# EAGLE design Smart_Dashboard (EAGLE 9.5.1)

## Sheet 1 of 3
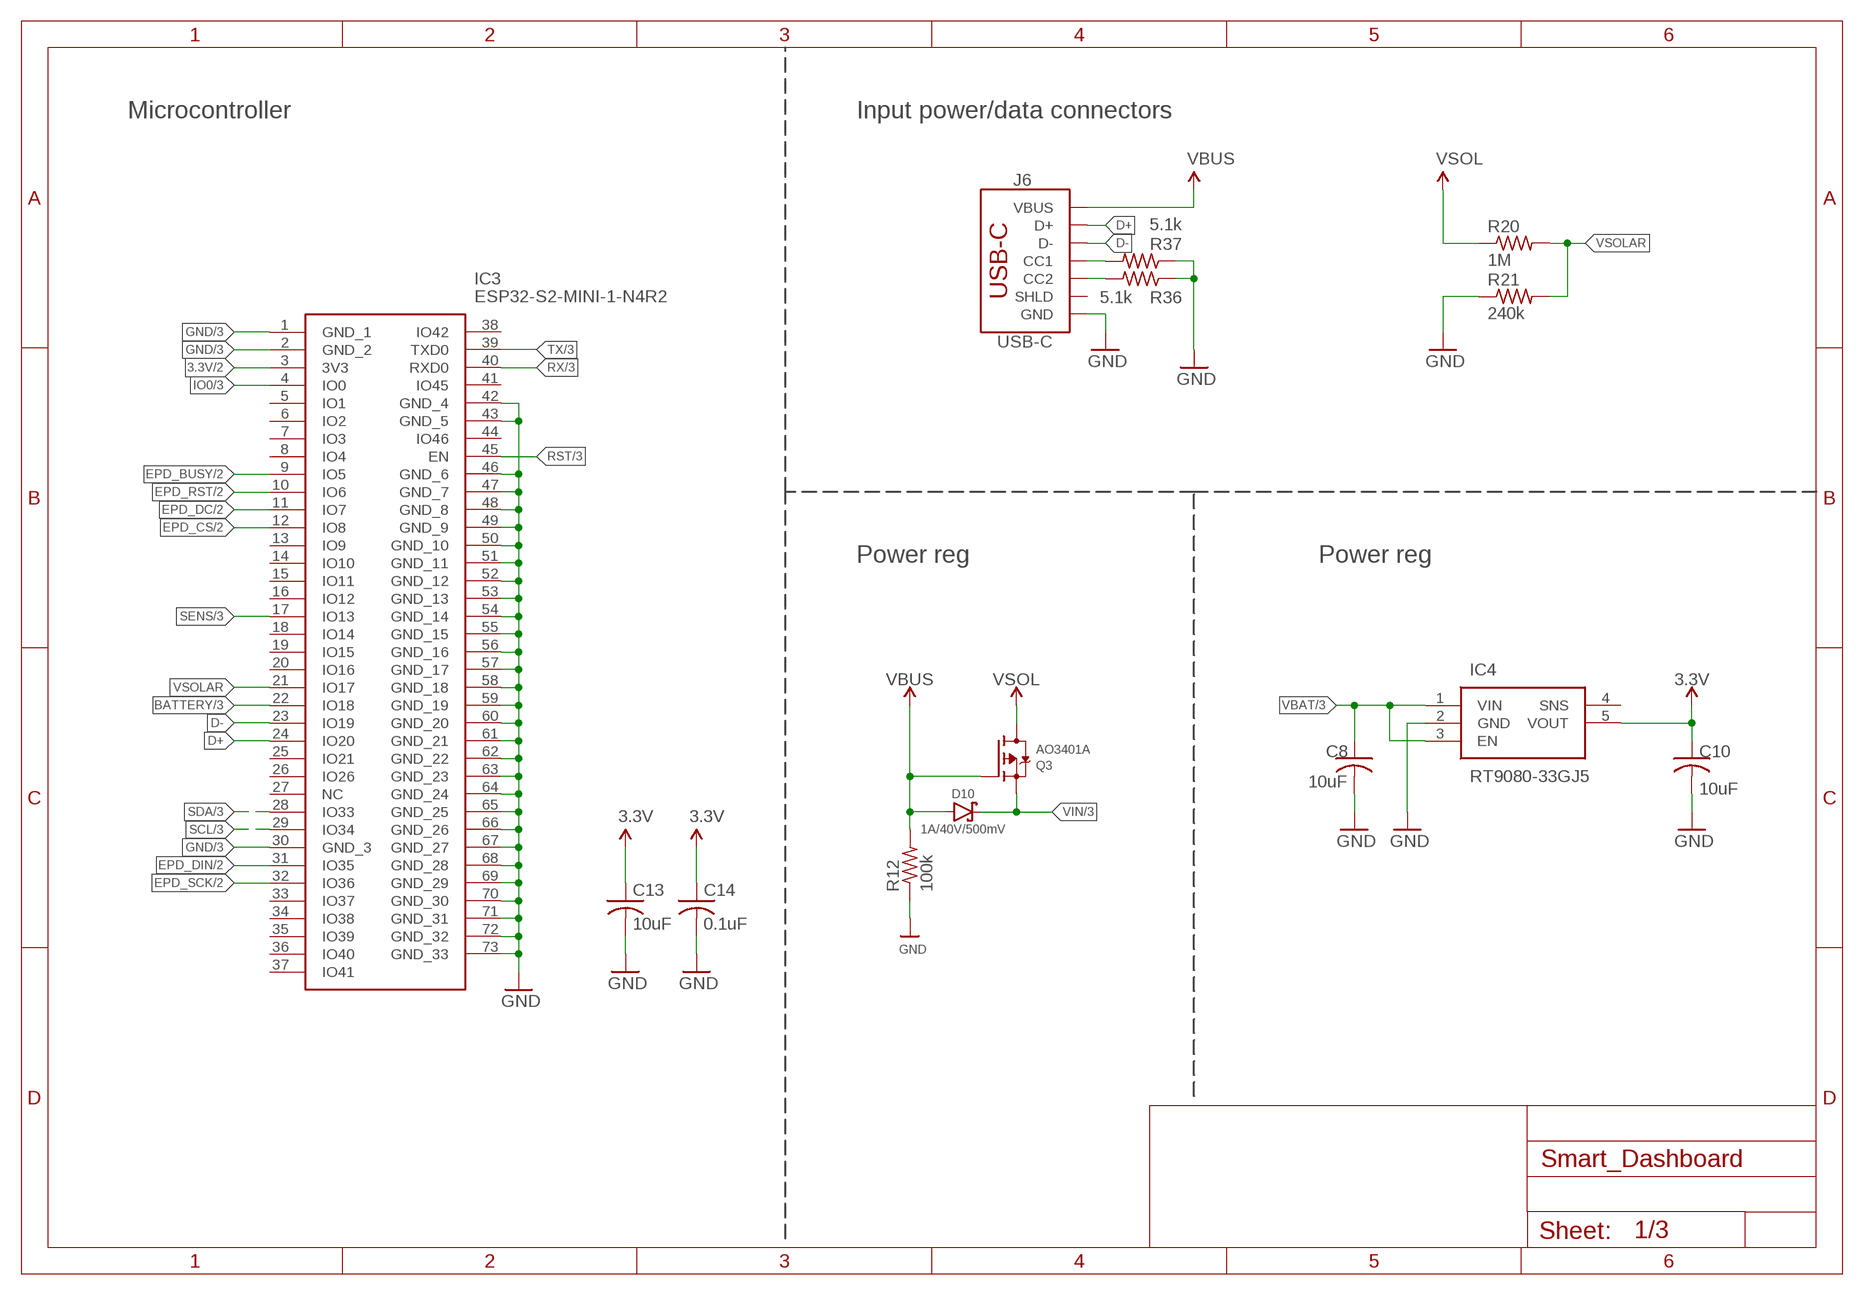
[diagram p0: schematic, sheet 1]

### Parts
C8  10uF  C-USC0603  [C0603]
C10  10uF  C-USC0603  [C0603]
C13  10uF  C-USC0603  [C0603]
C14  0.1uF  C-USC0603  [C0603]
D10  1A/40V/500mV  DIODE-SCHOTTKYSS14  [SMA-DIODE]
IC3  ESP32-S2-MINI-1-N4R2  [ESP32S2MINI1N4R2]
IC4  RT9080-33GJ5  [SOT94P280X100-5N]
J6  USB-C  USB_C_4-LAYER-ISOLATED  [USB-C-16P-4LAYER-ISOLATED]
Q3  AO3401A  MOSFET-P  [SOT23-R]
R12  100k  R-US_R0603  [R0603]
R20  1M  R-US_R0603  [R0603]
R21  240k  R-US_R0603  [R0603]
R36  5.1k  R-US_R0603  [R0603]
R37  5.1k  R-US_R0603  [R0603]

### Nets
3.3V: C10.1 C13.1 C14.1 IC3.3(3V3) IC4.5(VOUT) ; also sheet 2,3
BATTERY: IC3.22(IO18) ; also sheet 3
CC3: J6.B5(CC2) R36.2
CC4: J6.A5(CC1) R37.2
D+: IC3.24(IO20) J6.A6(D+) J6.B6(D+)
D-: IC3.23(IO19) J6.A7(D-) J6.B7(D-)
EPD_BUSY: IC3.9(IO5) ; also sheet 2
EPD_CS: IC3.12(IO8) ; also sheet 2
EPD_DC: IC3.11(IO7) ; also sheet 2
EPD_DIN: IC3.31(IO35) ; also sheet 2
EPD_RST: IC3.10(IO6) ; also sheet 2
EPD_SCK: IC3.32(IO36) ; also sheet 2
GND: C8.2 C10.2 C13.2 C14.2 IC3.1(GND_1) IC3.2(GND_2) IC3.30(GND_3) IC3.42(GND_4) IC3.43(GND_5) IC3.46(GND_6) IC3.47(GND_7) IC3.48(GND_8) IC3.49(GND_9) IC3.50(GND_10) IC3.51(GND_11) IC3.52(GND_12) IC3.53(GND_13) IC3.54(GND_14) IC3.55(GND_15) IC3.56(GND_16) IC3.57(GND_17) IC3.58(GND_18) IC3.59(GND_19) IC3.60(GND_20) IC3.61(GND_21) IC3.62(GND_22) IC3.63(GND_23) IC3.64(GND_24) IC3.65(GND_25) IC3.66(GND_26) IC3.67(GND_27) IC3.68(GND_28) IC3.69(GND_29) IC3.70(GND_30) IC3.71(GND_31) IC3.72(GND_32) IC3.73(GND_33) IC4.2(GND) J6.GND J6.GND2(GND) R12.1 R21.1 R36.1 R37.1 ; also sheet 2,3
IO0: IC3.4(IO0) ; also sheet 3
RST: IC3.45(EN) ; also sheet 3
RX: IC3.40(RXD0) ; also sheet 3
SCL: IC3.29(IO34) ; also sheet 3
SDA: IC3.28(IO33) ; also sheet 3
SENS: IC3.17(IO13) ; also sheet 3
TX: IC3.39(TXD0) ; also sheet 3
VBAT: C8.1 IC4.1(VIN) IC4.3(EN) ; also sheet 3
VBUS: D10.A J6.VBUS1(VBUS) J6.VBUS2(VBUS) Q3.1(G) R12.2
VIN: D10.C Q3.2(S) ; also sheet 3
VSOL: Q3.3(D) R20.1
VSOLAR: IC3.21(IO17) R20.2 R21.2
Unconnected: IC3.5(IO1) IC3.6(IO2) IC3.7(IO3) IC3.8(IO4) IC3.13(IO9) IC3.14(IO10) IC3.15(IO11) IC3.16(IO12) IC3.18(IO14) IC3.19(IO15) IC3.20(IO16) IC3.25(IO21) IC3.26(IO26) IC3.27(NC) IC3.33(IO37) IC3.34(IO38) IC3.35(IO39) IC3.36(IO40) IC3.37(IO41) IC3.38(IO42) IC3.41(IO45) IC3.44(IO46) IC4.4(SNS) J6.SHLD1(SHLD) J6.SHLD2(SHLD) J6.SHLD3(SHLD) J6.SHLD4(SHLD) J6.SHLD5(SHLD) J6.SHLD6(SHLD) J6.SHLD7(SHLD) J6.SHLD8(SHLD)

### Notes on the sheet
- Microcontroller | Input power/data connectors
- Power reg | Power reg

## Sheet 2 of 3
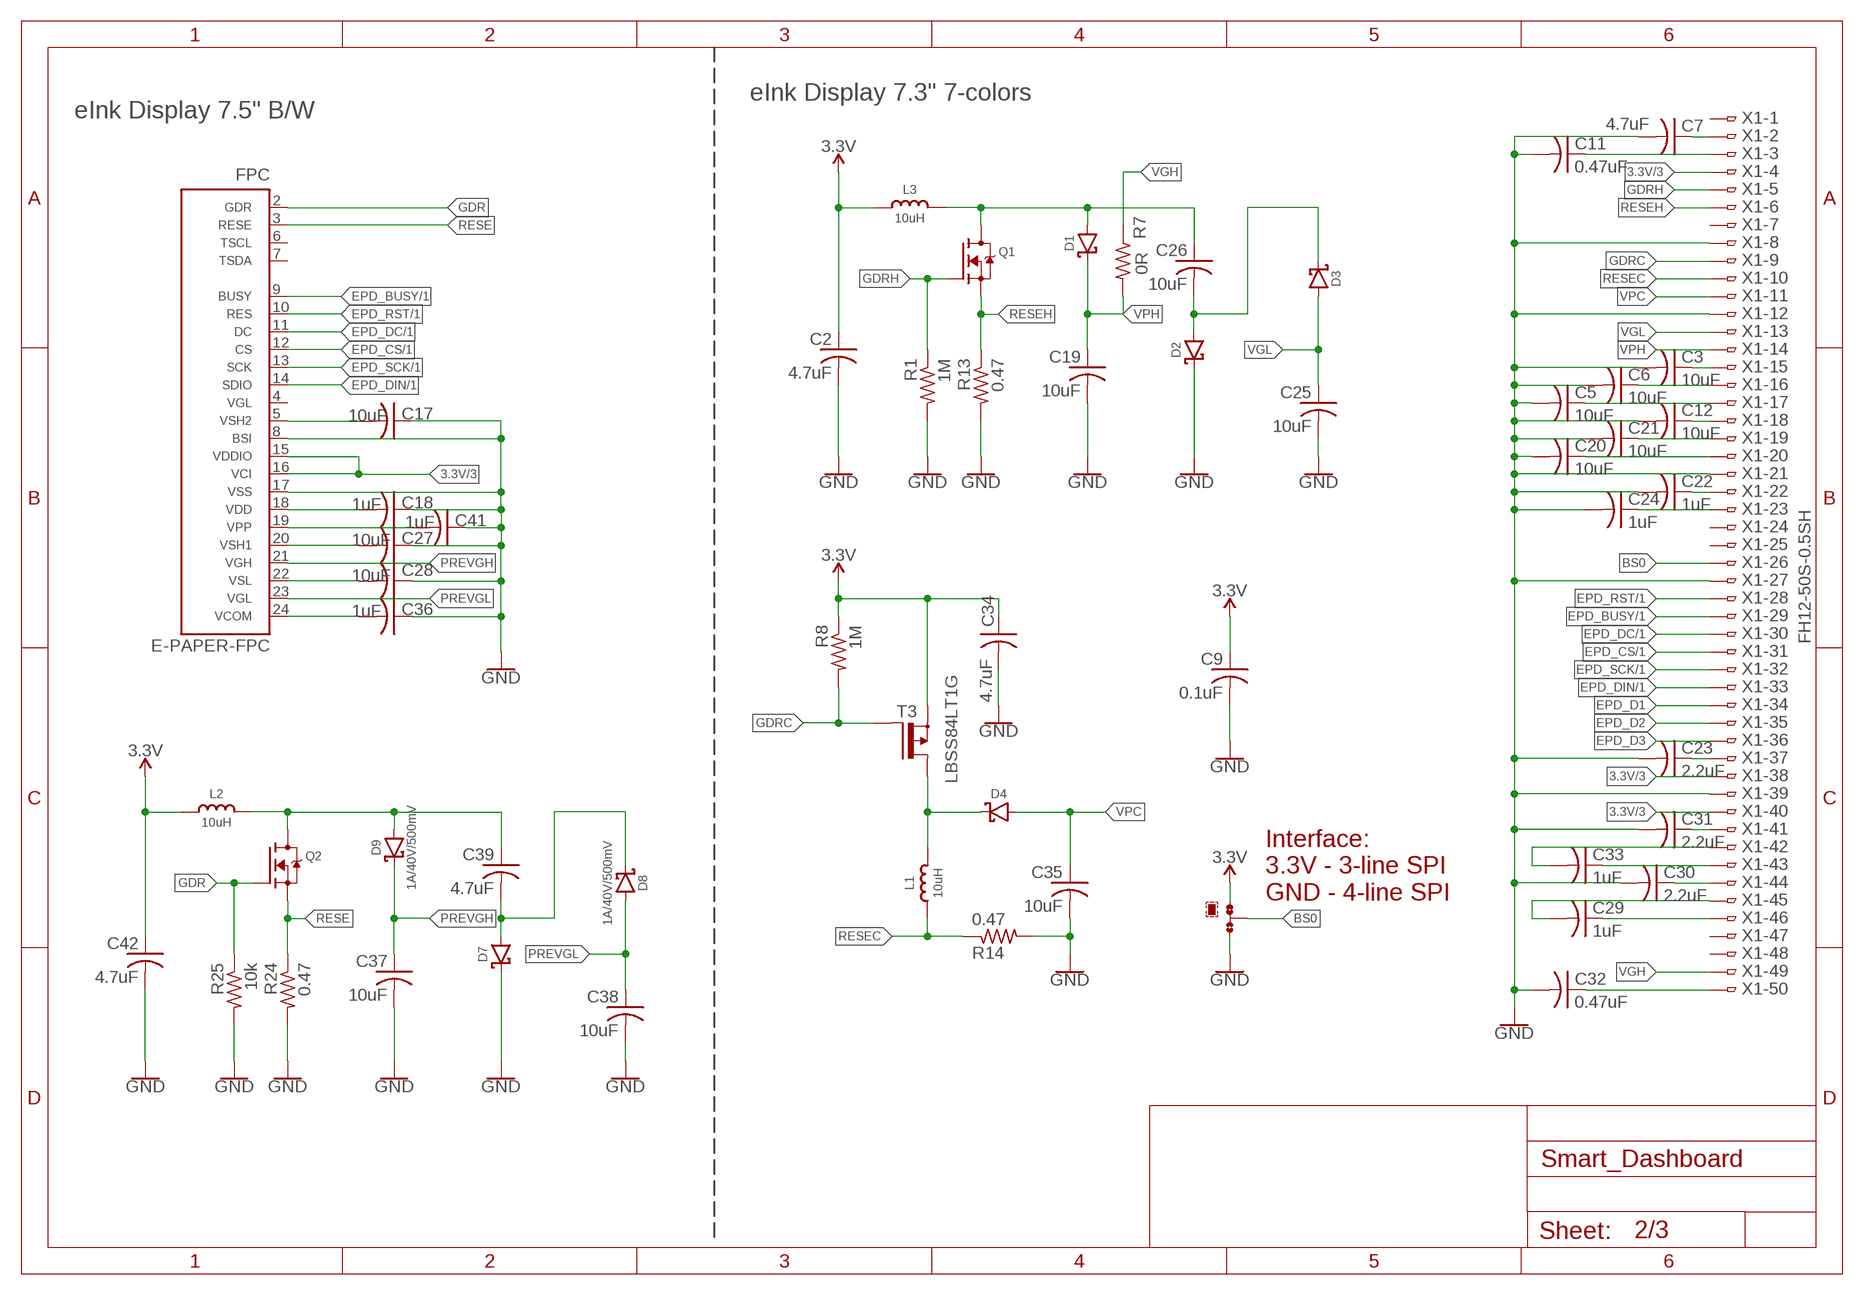
[diagram p1: schematic, sheet 2]

### Parts
C2  4.7uF  C-USC0603  [C0603]
C3  10uF  C-USC0603  [C0603]
C5  10uF  C-USC0603  [C0603]
C6  10uF  C-USC0603  [C0603]
C7  4.7uF  C-USC0603  [C0603]
C9  0.1uF  C-USC0603  [C0603]
C11  0.47uF  C-USC0603  [C0603]
C12  10uF  C-USC0603  [C0603]
C17  10uF  C-USC0603  [C0603]
C18  1uF  C-USC0603  [C0603]
C19  10uF  C-USC0603  [C0603]
C20  10uF  C-USC0603  [C0603]
C21  10uF  C-USC0603  [C0603]
C22  1uF  C-USC0603  [C0603]
C23  2.2uF  C-USC0603  [C0603]
C24  1uF  C-USC0603  [C0603]
C25  10uF  C-USC0603  [C0603]
C26  10uF  C-USC0603  [C0603]
C27  10uF  C-USC0603  [C0603]
C28  10uF  C-USC0603  [C0603]
C29  1uF  C-USC0603  [C0603]
C30  2.2uF  C-USC0603  [C0603]
C31  2.2uF  C-USC0603  [C0603]
C32  0.47uF  C-USC0603  [C0603]
C33  1uF  C-USC0603  [C0603]
C34  4.7uF  C-USC0603  [C0603]
C35  10uF  C-USC0603  [C0603]
C36  1uF  C-USC0603  [C0603]
C37  10uF  C-USC0603  [C0603]
C38  10uF  C-USC0603  [C0603]
C39  4.7uF  C-USC0603  [C0603]
C41  1uF  C-USC0603  [C0603]
C42  4.7uF  C-USC0603  [C0603]
D1  1A/40V/500mV  DIODE-SCHOTTKYSS14  [SMA-DIODE]
D2  1A/40V/500mV  DIODE-SCHOTTKYSS14  [SMA-DIODE]
D3  1A/40V/500mV  DIODE-SCHOTTKYSS14  [SMA-DIODE]
D4  1A/40V/500mV  DIODE-SCHOTTKYSS14  [SMA-DIODE]
D7  1A/40V/500mV  DIODE-SCHOTTKYSS14  [SMA-DIODE]
D8  1A/40V/500mV  DIODE-SCHOTTKYSS14  [SMA-DIODE]
D9  1A/40V/500mV  DIODE-SCHOTTKYSS14  [SMA-DIODE]
FPC  E-PAPER-FPC  [FPC-05FB-24PH20]
JMP1  0R-JUMPA  [A0R-JMP]
L1  10uH  INDUCTORNR401  [INDUCTOR_4X4MM_NR401]
L2  10uH  INDUCTORNR401  [INDUCTOR_4X4MM_NR401]
L3  10uH  INDUCTORNR401  [INDUCTOR_4X4MM_NR401]
Q1  IRLML0100  IRLML2060TRPBF  [SOT23-3]
Q2  IRLML0100  IRLML2060TRPBF  [SOT23-3]
R1  1M  R-US_R0603  [R0603]
R7  0R  R-US_R0603  [R0603]
R8  1M  R-US_R0603  [R0603]
R13  0.47  R-US_R0603  [R0603]
R14  0.47  R-US_R0603  [R0603]
R24  0.47  R-US_R0603  [R0603]
R25  10k  R-US_R0603  [R0603]
T3  LBSS84LT1G  T_P-MOSFET_LBSS84LT1G_LRC_SOT23-GSD  [SOT23]
X1  FH12-50S-0.5SH  [FH12-50S-0.5SH]

### Nets
3.3V: C2.1 C9.1 C34.1 C42.1 FPC.15 FPC.16 JMP1.1 L2.P$2 L3.P$2 R8.1 T3.2(S) X1.4 X1.38 X1.40 ; also sheet 1,3
BS0: JMP1.2 X1.26
EPD_BUSY: FPC.9 X1.29 ; also sheet 1
EPD_CS: FPC.12 X1.31 ; also sheet 1
EPD_D1: X1.34
EPD_D2: X1.35
EPD_D3: X1.36
EPD_DC: FPC.11 X1.30 ; also sheet 1
EPD_DIN: FPC.14 X1.33 ; also sheet 1
EPD_RST: FPC.10 X1.28 ; also sheet 1
EPD_SCK: FPC.13 X1.32 ; also sheet 1
GDR: FPC.2 Q2.1(G) R25.1
GDRC: R8.2 T3.1(G) X1.9
GDRH: Q1.1(G) R1.1 X1.5
GND: C2.2 C3.2 C5.2 C6.2 C7.2 C9.2 C11.2 C12.2 C17.1 C18.1 C19.2 C20.2 C21.2 C22.2 C23.2 C24.2 C25.2 C27.1 C28.1 C30.2 C31.2 C32.2 C34.2 C35.2 C36.1 C37.2 C38.2 C41.1 C42.2 D2.C D7.C FPC.8 FPC.17 JMP1.3 R1.2 R13.2 R14.2 R24.2 R25.2 X1.8 X1.12 X1.21 X1.27 X1.39 ; also sheet 1,3
N$5: C7.1 X1.2
N$7: C3.1 X1.15
N$8: C5.1 X1.17
N$12: C17.2 FPC.5
N$14: C18.2 FPC.18
N$15: C27.2 FPC.20
N$16: C26.2 D2.A D3.C
N$17: C26.1 D1.A L3.P$1 Q1.3(D)
N$31: C28.2 FPC.22
N$32: C36.2 FPC.24
N$35: C6.1 X1.16
N$47: C11.1 X1.3
N$49: C12.1 X1.18
N$50: C20.1 X1.20
N$51: C21.1 X1.19
N$52: C22.1 X1.22
N$53: C23.1 X1.37
N$54: C24.1 X1.23
N$55: C29.1 X1.46
N$56: C29.2 X1.45
N$57: C30.1 X1.44
N$58: C31.1 X1.41
N$59: C32.1 X1.50
N$61: C33.1 X1.43
N$62: C33.2 X1.42
N$63: C39.2 D7.A D8.C
N$64: D4.C L1.P$1 T3.3(D)
N$65: C39.1 D9.A L2.P$1 Q2.3(D)
N$67: C41.2 FPC.19
PREVGH: C37.1 D9.C FPC.21
PREVGL: C38.1 D8.A FPC.23
RESE: FPC.3 Q2.2(S) R24.1
RESEC: L1.P$2 R14.1 X1.10
RESEH: Q1.2(S) R13.1 X1.6
VGH: R7.1 X1.49
VGL: C25.1 D3.A X1.13
VPC: C35.1 D4.A X1.11
VPH: C19.1 D1.C R7.2 X1.14
Unconnected: FPC.4 FPC.6 FPC.7 X1.1 X1.7 X1.24 X1.25 X1.47 X1.48

### Notes on the sheet
- eInk Display 7.3" 7-colors
- eInk Display 7.5" B/W
- Interface:
  3.3V - 3-line SPI
  GND - 4-line SPI

## Sheet 3 of 3
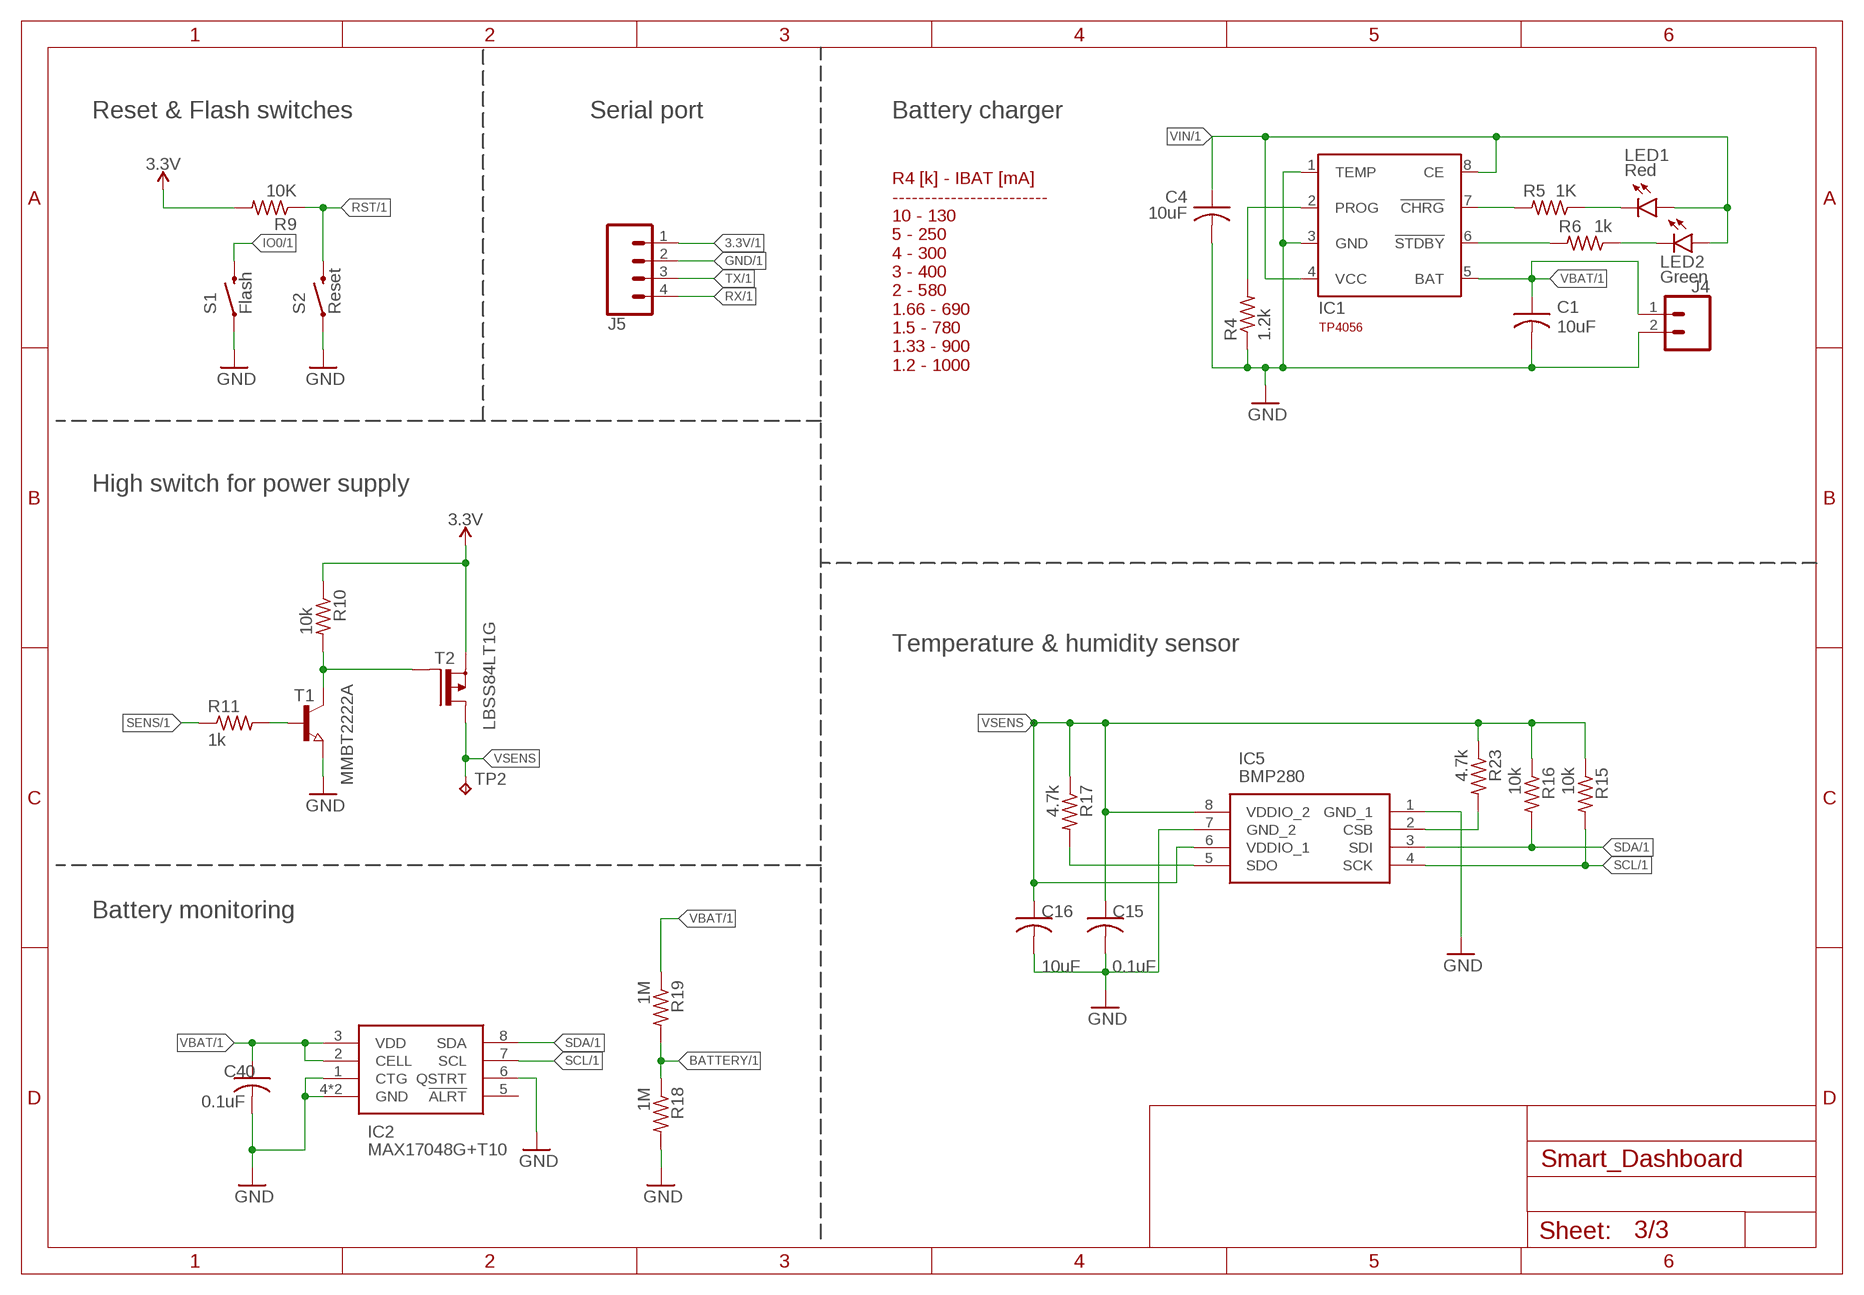
[diagram p2: schematic, sheet 3]

### Parts
C1  10uF  C-USC0603  [C0603]
C4  10uF  C-USC0603  [C0603]
C15  0.1uF  C-USC0603  [C0603]
C16  10uF  C-USC0603  [C0603]
C40  0.1uF  C-USC0603  [C0603]
IC1  TP4056  [SOT23-8]
IC2  MAX17048G+T10  [SON50P200X200X80-9N]
IC5  BMP280  [8-PIN-METAL-LID-LGA]
J4  CONN_02-JST-2MM-SMT  [JST-2-SMD]
J5  CONN_04PTH  [1X04]
LED1  Red  LED0603  [LED_0603]
LED2  Green  LED0603  [LED_0603]
R4  1.2k  R-US_R0603  [R0603]
R5  1K  R-US_R0603  [R0603]
R6  1k  R-US_R0603  [R0603]
R9  10K  R-US_R0603  [R0603]
R10  10k  R-US_R0603  [R0603]
R11  1k  R-US_R0603  [R0603]
R15  10k  R-US_R0603  [R0603]
R16  10k  R-US_R0603  [R0603]
R17  4.7k  R-US_R0603  [R0603]
R18  1M  R-US_R0603  [R0603]
R19  1M  R-US_R0603  [R0603]
R23  4.7k  R-US_R0603  [R0603]
S1  Flash  MOMENTARY-SWITCH-SPST-SMD-5.2MM-TALL  [TACTILE_SWITCH_SMD_5.2MM]
S2  Reset  MOMENTARY-SWITCH-SPST-SMD-5.2MM-TALL  [TACTILE_SWITCH_SMD_5.2MM]
T1  MMBT2222A  T_NPN_MMBT2222A-1P_CHANGJ_SOT23-BEC  [SOT23]
T2  LBSS84LT1G  T_P-MOSFET_LBSS84LT1G_LRC_SOT23-GSD  [SOT23]
TP2  TPB1,27  [B1,27]

### Nets
3.3V: J5.1 R9.2 R10.1 T2.2(S) ; also sheet 1,2
BATTERY: R18.1 R19.2 ; also sheet 1
GND: C1.2 C4.2 C15.2 C16.2 C40.2 IC1.1(TEMP) IC1.3(GND) IC2.1(CTG) IC2.4(GND) IC2.6(QSTRT) IC2.9(GND) IC5.1(GND_1) IC5.7(GND_2) J4.2 J5.2 R4.1 R18.2 S1.1 S2.1 T1.2(E) ; also sheet 1,2
IO0: S1.3 ; also sheet 1
N$1: IC1.6(!STDBY) R6.2
N$2: LED1.C R5.1
N$3: LED2.C R6.1
N$4: IC1.2(PROG) R4.2
N$6: IC1.7(!CHRG) R5.2
N$9: R10.2 T1.3(C) T2.1(G)
N$10: IC5.5(SDO) R17.2
N$13: IC5.2(CSB) R23.2
N$18: R11.2 T1.1(B)
RST: R9.1 S2.3 ; also sheet 1
RX: J5.4 ; also sheet 1
SCL: IC2.7(SCL) IC5.4(SCK) R15.2 ; also sheet 1
SDA: IC2.8(SDA) IC5.3(SDI) R16.2 ; also sheet 1
SENS: R11.1 ; also sheet 1
TX: J5.3 ; also sheet 1
VBAT: C1.1 C40.1 IC1.5(BAT) IC2.2(CELL) IC2.3(VDD) J4.1 R19.1 ; also sheet 1
VIN: C4.1 IC1.4(VCC) IC1.8(CE) LED1.A LED2.A ; also sheet 1
VSENS: C15.1 C16.1 IC5.6(VDDIO_1) IC5.8(VDDIO_2) R15.1 R16.1 R17.1 R23.1 T2.3(D) TP2.TP
Unconnected: IC2.5(!ALRT)

### Notes on the sheet
- Reset & Flash switches | Serial port | Battery charger
- R4 [k] - IBAT [mA]
  ------------------------
  10 - 130
  5 - 250
  4 - 300
  3 - 400
  2 - 580
  1.66 - 690
  1.5 - 780
  1.33 - 900
  1.2 - 1000
- High switch for power supply
- Temperature & humidity sensor
- Battery monitoring

## Library data of the parts
C1-C42 = rcl:C-US: CAPACITOR, American symbol; SPICEPREFIX: C
D1-D4 D7-D10 = SpaceDIY_semiconductors:DIODE-SCHOTTKY: Schottky diode A Schottky diode is a semiconductor diode which has a low forward voltage drop and a very fast switching action.; PROD_ID: DIO-08053
FPC = SpaceDIY_connectors:E-PAPER-FPC; LCSC: C2856831
IC1 = TP4056:TP4056: TP4056 Data sheet <http://goo.gl/J7k8TF> Dave.Calaway Eagle Library <https://goo.gl/Muy1Tr>; LCSC: C16581
IC2 = SpaceDIY_IC:MAX17048G+T10: Battery Management Host-Side Modelgauge (1-Cell) Source: Datasheet <https://datasheets.maximintegrated.com/en/ds/MAX17048-MAX17049.pdf>; LCSC: C2682616
IC3 = SpaceDIY_modules:ESP32-S2-MINI-1-N4R2: WiFi Modules - 802.11 SMD module, ESP32-S2FN4R2 with 4 MB flash die and 2 MB PSRAM die inside, PCB antenna Source: Datasheet <https://cz.mouser.com/datasheet/2/891/esp32_s2_mini_1_esp32_s2_mini_1u_datasheet_en-1928084.pdf>; DESCRIPTION: WiFi Modules - 802.11 SMD module, ESP32-S2FN4R2 with 4 MB flash die and 2 MB PSRAM die inside, PCB antenna; HEIGHT: 2.55mm; MANUFACTURER_NAME: Espressif Systems; MANUFACTURER_PART_NUMBER: ESP32-S2-MINI-1-N4R2; MOUSER_PART_NUMBER: 356-ESP32S2MINI1N4R2; MOUSER_PRICE-STOCK: https://www.mouser.co.uk/ProductDetail/Espressif-Systems/ESP32-S2-MINI-1-N4R2?qs=iLbezkQI%252Bsgb61FCBnw%252B9A%3D%3D
IC4 = SamacSys_Parts:RT9080-33GJ5: IC REG LIN 3.3V 600MA TSOT23-5 Source: Datasheet <https://www.richtek.com/assets/product_file/RT9080/DS9080-05.pdf>; DESCRIPTION: IC REG LIN 3.3V 600MA TSOT23-5; HEIGHT: 1mm; LCSC: C841192; MANUFACTURER_NAME: RICHTEK; MANUFACTURER_PART_NUMBER: RT9080-33GJ5
IC5 = SamacSys_Parts:BMP280: Digital Pressure Sensor Source: Datasheet <https://datasheet.datasheetarchive.com/originals/distributors/DKDS-24/462913.pdf>; ARROW_PART_NUMBER: BMP280; ARROW_PRICE-STOCK: https://www.arrow.com/en/products/bmp280/bosch?region=nac; DESCRIPTION: Digital Pressure Sensor; HEIGHT: mm; MANUFACTURER_NAME: BOSCH; MANUFACTURER_PART_NUMBER: bmp280; MOUSER_PART_NUMBER: 262-BMP280; MOUSER_PRICE-STOCK: https://www.mouser.co.uk/ProductDetail/Bosch-Sensortec/BMP280?qs=QhAb4EtQfbUP9Z%252BCHM3Wyg%3D%3D
J4 = SpaceDIY_connectors:CONN_02: Multi connection point. Often used as Generic Header-pin footprint for 0.1 inch spaced/style header connections On any of the 0.1 inch spaced packages, you can populate with these: Break Away Headers - Straight <https://www.sparkfun.com/products/116> (PRT-00116) Break Away Male Headers - Right Angle <https://www.sparkfun.com/products/553> (PRT-00553) Female Headers <https://www.sparkfun.com/products/115> (PRT-00115) Break Away Headers - Machine Pin <https://www.sparkfun.com/products/117> (PRT-00117) Break Away Female Headers - Swiss Machine Pin <https://www.sparkfun.com/products/743> (PRT-00743) For SCREWTERMINALS and SPRING TERMINALS visit here: Screw Terimnals on SparkFun.com <https://www.sparkfun.com/search/results?term=Screw+Terminals> (5mm/3.5mm/2.54mm spacing) This device is also useful as a general connection point to wire up your design to another part of your project. Our various solder wires solder well into these plated through hole pads. Hook-Up Wire - Assortment (Stranded, 22 AWG) <https://www.sparkfun.com/products/11375> (PRT-11375) Hook-Up Wire - Assortment (Solid Core, 22 AWG) <https://www.sparkfun.com/products/11367> (PRT-11367) View the entire wire category on our website here <https://www.sparkfun.com/categories/141> Special notes: Molex polarized connector foot print use with: PRT-08233 with associated crimp pins and housings. 2.54_SCREWTERM for use with PRT-10571. 3.5mm Screw Terminal footprints for PRT-08084 5mm Screw Terminal footprints for use with PRT-08432; LCSC: C3029440; PROD_ID: CONN-11443
J5 = SparkFun-Connectors:CONN_04: Multi connection point. Often used as Generic Header-pin footprint for 0.1 inch spaced/style header connections On any of the 0.1 inch spaced packages, you can populate with these: Break Away Headers - Straight <https://www.sparkfun.com/products/116> (PRT-00116) Break Away Male Headers - Right Angle <https://www.sparkfun.com/products/553> (PRT-00553) Female Headers <https://www.sparkfun.com/products/115> (PRT-00115) Break Away Headers - Machine Pin <https://www.sparkfun.com/products/117> (PRT-00117) Break Away Female Headers - Swiss Machine Pin <https://www.sparkfun.com/products/743> (PRT-00743) For SCREWTERMINALS and SPRING TERMINALS visit here: Screw Terimnals on SparkFun.com <https://www.sparkfun.com/search/results?term=Screw+Terminals> (5mm/3.5mm/2.54mm spacing) This device is also useful as a general connection point to wire up your design to another part of your project. Our various solder wires solder well into these plated through hole pads. Hook-Up Wire - Assortment (Stranded, 22 AWG) <https://www.sparkfun.com/products/11375> (PRT-11375) Hook-Up Wire - Assortment (Solid Core, 22 AWG) <https://www.sparkfun.com/products/11367> (PRT-11367) View the entire wire category on our website here <https://www.sparkfun.com/categories/141> Special notes: Molex polarized connector foot print use with SKU : PRT-08231 with associated crimp pins and housings. 1MM SMD Version SKU: PRT-10208; PROD_ID: CONN-09696
J6 = SparkFun-Connectors:USB_C: USB Type C 16Pin Connector Super Speed pins not available on the 16-pin purely SMD connector so this part is best for USB 2.0 implementations. D1 and D2 are tied together enabling D+/- no matter which way the cable is plugged into the connector. The two channel configuration pins (CC1/2) are exposed. These are normally connected to ground via 5.1k resistors but can be reconfigured for high current/high power applications. **4-LAYER BOARD WARNING!!** If designing 4-layer board, make sure to select the variant _4-LAYER-ISOLATED. The linked footprint (USB-C-16-4LAYER-ISOLATED) includes some very necessary cutout polygons in the inner layers (2 and 15). This prevents the PTH mounting shield legs on the USB connector from electrically connecting any other polygons on the inner layers (usually VCC and GND).; LCSC: C2765186; PROD_ID: CONN-14122; VALUE: USB Female Type C Connector
JMP1 = jump-0r-smd:0R-JUMP: SMD 0R 0805 Jumper
L1-L3 = microbuilder:INDUCTOR: Inductors 0603: 10nH Ceramic Inductor - microwire antenna/RF (Digikey: 712-1434-2-ND) 0805: 560nH Ceramic Inductor - RF (Digikey: 553-1047-1-ND) 270nH Ceramic Inductor - Q = 40@250MHz, +-5%, 1 Ohm DC Resistance (Digikey: 535-10506-2-ND) 1007 (2518 Metric) SMT: 10µH 10% 250mOhm 820mA 1007 Inductor (Digikey: 587-2189-1-ND) 22µH 10% 500mOhm 580mA 1007 Inductor (Digikey: 587-2190-1-ND) 47µH 10% 950mOhm 420mA 1007 Inductor (Digikey: 587-2191-1-ND) 47µH 5% 100mOhm 1A 1008 Inductor (Digikey: 732-1816-1-ND) 5.0x5.0mm (Taiyo Yuden NR5040 Series) 6.8µH 20% 2.3A 64mOhm Inductor (Digikey: 587-2374-2-ND) 5.0x5.0mm (TDK VLC5045 Series) 4.7µH 20% 3.3A 34mOhm Inductor (Digikey: 445-6526-1-ND) 6.8µH 20% 2.7A 46mOhm Inductor (Digikey: 445-6527-1-ND) 6.0x6.0mm (TDK VLC6045 Series) 4.7µH 20% 3.8A 27mOhm Inductor (Digikey: 445-6538-2-ND) 6.8µH 20% 3A 41mOhm Inductor (Digikey: 445-6540-1-ND) 6.2µH 30% 2.2A 45mOhm Inductor (Digikey: SRR5028-6R2YCT-ND) - Not TDK VLC6045 but footprint should match 6.0x6.0mm (TDK SLF6045 Series) 6.8uH 30% 2A 33mOhm Inductor (Digikey: 445-4572-1-ND, Mouser: 810-SLF645T6R8N2R0PF) 6.0x6.0mm (Sumida CDRH5D28 Series) 6.2uH 30% 1.8A 45mOhm Inductor (Digikey: 308-1542-1-ND) Taiyo Yuden NR3015T2R2M - 2.2uH 20% 1.5A (Digikey: 587-1648-2-ND, Mouser: 963-NR3015T2R2M) - Used with TI TPS62172 CoilCraft RFID Transponder Coil - MA5532-AE (For use with AS3935 Lightning Sensor) Taiyo Yuden NRH2412T2R2MNGH - 2.2uH 20% 1AA (Digikey: 587-3443-1-ND) - Used with TI LM3671 Vishay IHLP 1.0uH Molded Inductor - 24mOhm DCR, 5A, +/-20%, -55°C-125°C (Digikey: 541-1319-1-ND)
LED1 LED2 = SpaceDIY_semiconductors:LED: LED (Generic) Standard schematic elements and footprints for 5mm, 3mm, 0402, 0603 , 0805 and 1206 sized LEDs. Generic LEDs with no color specified.
Q1 Q2 = Parts:IRLML2060TRPBF
Q3 = microbuilder:MOSFET-P: P-Channel Mosfet LEGEND VDS: Voltage Drain-Source ID: Drain Current RDS(ON): Drain-Source On-State Resistance VGS(TH): Gate-Source Threshold Voltage CISS: Drain-Source Input Capacitance SOT-23 Name VDS ID RDS(ON) VGS(TH) CISS Order Number IRLML5103 30V 760mA 600 mOhm -- 75pF @ 25V Digikey: IRLML5103PBFCT-ND IRLML6401 12V 4.3A 50 mOhm 950mV @ 250µA 830pF @ 10V Digikey: IRLML6401PBFTR-ND NTR0202PL 20V 400mA 800 mOhm 2.3V @ 250uA 70pF @ 5V Digikey: NTR0202PLT1GOSTR-ND NTR4101PT1G 20V 1.8A 85 mOhm 1.2V @ 250uA 675pF @ 10V Digikey: NTR4101PT1GOSCT-ND DMP2004K 20V 600mA 900 mOhm 1V @ 250uA 175pF @ 16V Digikey: DMP2004KDICT-ND PMV65XP 20V 3.9A 76 mOhm 950mV @ 1mA 725pF @ 20V Digikey: 568-2358-2-ND TO-252 Name VDS ID RDS(ON) VGS(TH) CISS Order Number AOD417 30V 25A 34 mOhm 3V @ 250µA 920pF @ 15V Digikey: 785-1106-2-ND PowerPak Name VDS ID RDS(ON) VGS(TH) CISS Order Number AON7401 30V 12A 14 mOhm 3V @ 250µA 2600pF @ 15V Digikey: 785-1302-1-ND; LCSC: C15127
R1 R4-R21 R23-R25 R36 R37 = rcl:R-US_: RESISTOR, American symbol; SPICEPREFIX: R
S1 S2 = SpaceDIY_electromechanical:MOMENTARY-SWITCH-SPST: Momentary Switch (Pushbutton) - SPST Normally-open (NO) SPST momentary switches (buttons, pushbuttons). Variants PTH-12MM - 12mm square, through-hole Momentary Pushbutton Switch - 12mm Square <https://www.sparkfun.com/products/9190> (COM-09190) PTH-6.0MM, PTH-6.0MM-KIT - 6.0mm square, through-hole Mini Pushbutton Switch <https://www.sparkfun.com/products/97> (COM-00097) KIT package intended for soldering kit's - only one side of pads' copper is exposed. PTH-RIGHT-ANGLE-KIT - Right-angle, through-hole Right Angle Tactile Button <https://www.sparkfun.com/products/10791> - Used on SparkFun BigTime Watch Kit <https://www.sparkfun.com/products/11734> SMD-12MM - 12mm square, surface-mount Tactile Button - SMD (12mm) <https://www.sparkfun.com/products/12993> (COM-12993) Used on SparkFun PicoBoard <https://www.sparkfun.com/products/11888> SMD-4.5MM - 4.5mm Square Trackball Switch Used on SparkFun Blackberry Trackballer Breakout <https://www.sparkfun.com/products/13169> SMD-4.6MMX2.8MM - 4.60mm x 2.80mm, surface mount Used on SparkFun Pro Micro - RP2040 <https://www.sparkfun.com/products/17717> SMD-5.2MM, SMD-5.2-REDUNDANT - 5.2mm square, surface-mount Mini Pushbutton Switch - SMD <https://www.sparkfun.com/products/8720> (COM-08720) Used on Arduino Pro Mini <https://www.sparkfun.com/products/11114> REDUNDANT package connects both switch circuits together SMD-6.0X3.5MM - 6.0 x 3.5mm, surface mount Momentary Reset Switch SMD <https://www.sparkfun.com/products/8229> (COM-08229) SMD-6.2MM-TALL - 6.2mm square, surface mount Tactile Button - SMD (6mm) <https://www.sparkfun.com/products/12992> Used on SparkFun Digital Sandbox <https://www.sparkfun.com/products/12651> SMD-RIGHT-ANGLE - Right-angle, surface mount Used on SparkFun Block for Intel® Edison - Arduino <https://www.sparkfun.com/products/13036>; LCSC: C318884; PROD_ID: SWCH-14139
T1 = JLC PCB Basic Parts_loc:T_NPN_: Transistor NPN; LCSC_DATASHEET: https://datasheet.lcsc.com/lcsc/1811081957_Changjiang-Electronics-Tech--CJ-MMBT2222A-1P_C8512.pdf; LCSC_PART: C8512; LCSC_PRICE1_EUR: 0.023149606; LCSC_ROTATION_CCW: 180; PROPERTIES: 0.3W NPN 0.6A 40V SOT-23(SOT-23-3) Bipolar Transistors - BJT ROHS
T2 T3 = JLC PCB Basic Parts_loc:T_P-MOSFET_: Transistor P-MOSFET; LCSC_DATASHEET: https://datasheet.lcsc.com/lcsc/1811031711_LRC-LBSS84LT1G_C8492.pdf; LCSC_PART: C8492; LCSC_PRICE1_EUR: 0.031496063; LCSC_ROTATION_CCW: 180; PROPERTIES: 2V 250uA 10Ohm 100mA,5V 0.13A 0.225W P Channel 50V SOT-23(SOT-23-3) MOSFETs ROHS
TP2 = testpad:TP: Test pad
X1 = con-hirose:FH12-50S-0.5S: 0.5mm Pitch Connectors For FPC/FFC Source: Data sheet <http://www.hirose.co.jp/cataloge_hp/e58605370.pdf>; MPN: FH12-50S-0.5SH(55); OC_FARNELL: 1324557; OC_NEWARK: 34M6181

## Net classes
3 Power: width 0.305 mm, drill 0.483 mm

## Board
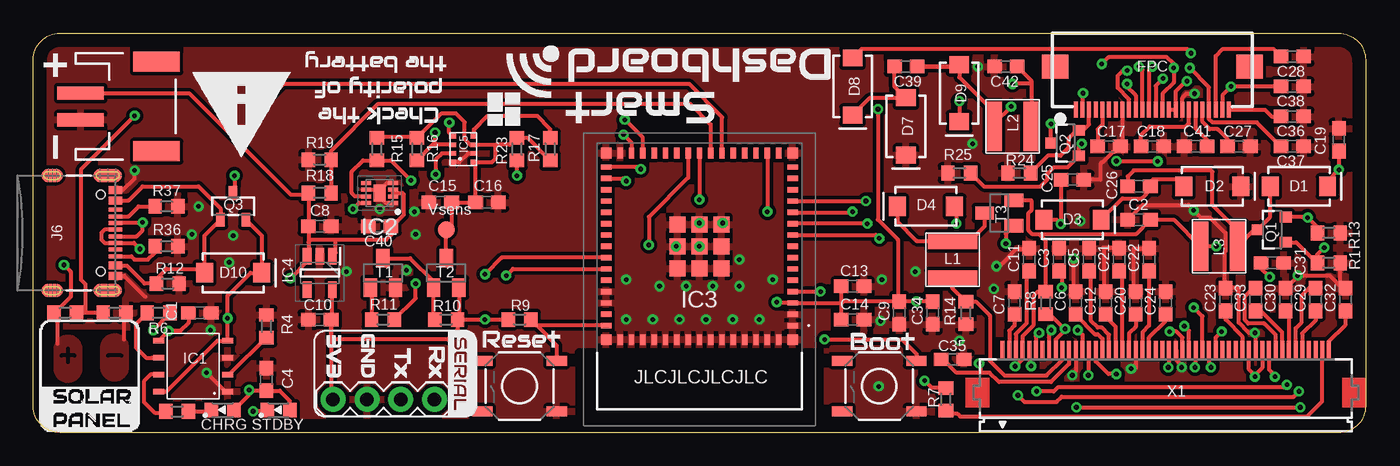
[diagram p3: board, top side]
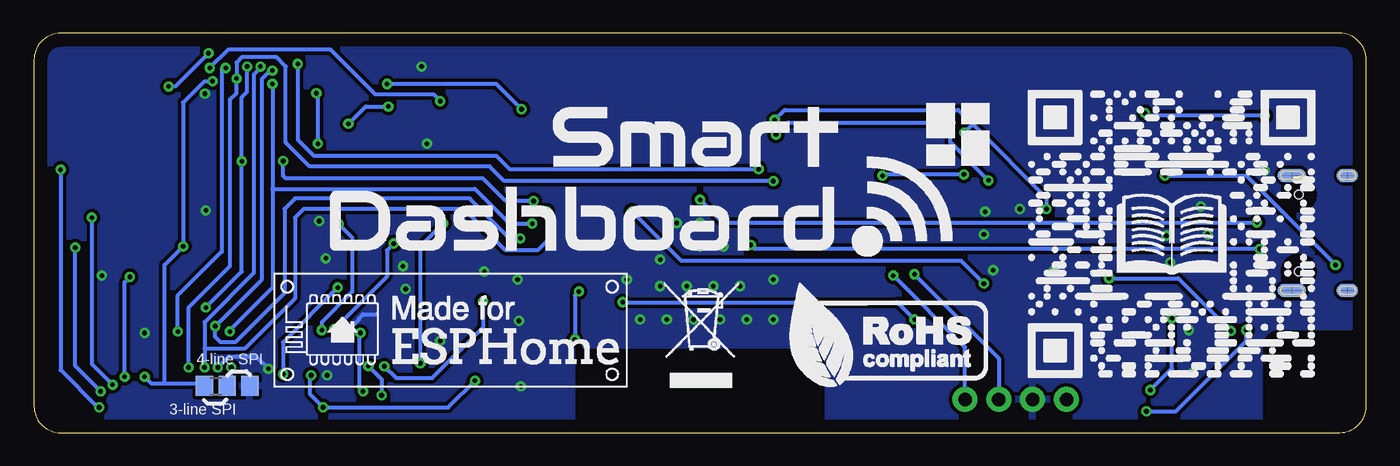
[diagram p4: board, bottom side, seen from below]

Size 100 x 30 mm. Coordinates in mm from the lower left corner, seen from the top.
Outline: 98,30 arc-90 100,28 100,2 arc-90 98,0 2,0 arc-90 0,2 0,28 arc-90 2,30 98,30
Copper layers (1*16): Top 0.035mm / dielectric 1.5mm / Bottom 0.035mm
Design rules "default": minimum track width 6mil, minimum drill 0.35mm, track to track 6mil, track to pad 6mil, pad to pad 6mil, via to via 6mil, smd to smd 6mil, copper to edge 40mil, drill to drill 6mil, minimum pad ring 10mil, minimum via ring 8mil, stop-mask expansion 4mil, vias tented up to drill 0mil, thermal gap 10mil
tRestrict: 3 lines

### Footprints (pad centres in the part's own frame; a part is rotated, then mirrored left to right if it is on the bottom)
C0603 = smd 1.1 x 1: 1 -0.85,0; 2 0.85,0
SMA-DIODE = smd 1.27 x 1.47: A -2.15,0; C 2.15,0
FPC-05FB-24PH20 = smd 0.3 x 1.2: 1 5.75,3.25; 2 5.25,3.25; 3 4.75,3.25; 4 4.25,3.25; 5 3.75,3.25; 6 3.25,3.25; 7 2.75,3.25; 8 2.25,3.25; 9 1.75,3.25; 10 1.25,3.25; 11 0.75,3.25; 12 0.25,3.25; 13 -0.25,3.25; 14 -0.75,3.25; 15 -1.25,3.25; 16 -1.75,3.25; 17 -2.25,3.25; 18 -2.75,3.25; 19 -3.25,3.25; 20 -3.75,3.25; 21 -4.25,3.25; 22 -4.75,3.25; 23 -5.25,3.25; 24 -5.75,3.25 | smd 2 x 1.8: P$25 -7.3,0; P$26 7.3,0
SOT23-8 = smd 0.42 x 0.835: 1 -1.905,-2.58; 2 -0.635,-2.58; 3 0.635,-2.58; 4 1.905,-2.58; 5 1.905,2.58; 6 0.635,2.58; 7 -0.635,2.58; 8 -1.905,2.58
SON50P200X200X80-9N = smd 0.75 x 0.3: 1 -1,0.75; 2 -1,0.25; 3 -1,-0.25; 4 -1,-0.75; 5 1,-0.75; 6 1,-0.25; 7 1,0.25; 8 1,0.75 | smd 0.9 x 1.3: 9 0,0
ESP32S2MINI1N4R2 = smd 0.8 x 0.4: 1 -7,5.95; 2 -7,5.1; 3 -7,4.25; 4 -7,3.4; 5 -7,2.55; 6 -7,1.7; 7 -7,0.85; 8 -7,0; 9 -7,-0.85; 10 -7,-1.7; 11 -7,-2.55; 12 -7,-3.4; 13 -7,-4.25; 14 -7,-5.1; 15 -7,-5.95; 31 7,-5.95; 32 7,-5.1; 33 7,-4.25; 34 7,-3.4; 35 7,-2.55; 36 7,-1.7; 37 7,-0.85; 38 7,0; 39 7,0.85; 40 7,1.7; 41 7,2.55; 42 7,3.4; 43 7,4.25; 44 7,5.1; 45 7,5.95 | smd 0.4 x 0.8: 16 -5.95,-7; 17 -5.1,-7; 18 -4.25,-7; 19 -3.4,-7; 20 -2.55,-7; 21 -1.7,-7; 22 -0.85,-7; 23 0,-7; 24 0.85,-7; 25 1.7,-7; 26 2.55,-7; 27 3.4,-7; 28 4.25,-7; 29 5.1,-7; 30 5.95,-7; 46 5.95,7; 47 5.1,7; 48 4.25,7; 49 3.4,7; 50 2.55,7; 51 1.7,7; 52 0.85,7; 53 0,7; 54 -0.85,7; 55 -1.7,7; 56 -2.55,7; 57 -3.4,7; 58 -4.25,7; 59 -5.1,7; 60 -5.95,7 | smd 1.2 x 1.2: 61 0,0; 66 -1.65,1.65; 67 -1.65,0; 68 -1.65,-1.65; 69 0,-1.65; 70 1.65,-1.65; 71 1.65,0; 72 1.65,1.65; 73 0,1.65 | smd 0.8 x 0.8: 62 -7,7; 63 -7,-7; 64 7,-7; 65 7,7
SOT94P280X100-5N = smd 1.25 x 0.65: 1 -1.25,0.94; 2 -1.25,0; 3 -1.25,-0.94; 4 1.25,-0.94; 5 1.25,0.94
8-PIN-METAL-LID-LGA = smd 0.5 x 0.35: 1 0.8,0.975; 2 0.8,0.325; 3 0.8,-0.325; 4 0.8,-0.975; 5 -0.8,-0.975; 6 -0.8,-0.325; 7 -0.8,0.325; 8 -0.8,0.975
JST-2-SMD = smd 1 x 3.5: 1 1,3.95; 2 -1,3.95 | smd 1.5 x 3.5: NC1 3.35,-1.75; NC2 -3.35,-1.75
1X04 = drill 1.016 pad 1.88: 1 0,0; 2 2.54,0; 3 5.08,0; 4 7.62,0
USB-C-16P-4LAYER-ISOLATED = smd 0.3 x 1: A5 -1.25,-0.34; A6 -0.25,-0.34; A7 0.25,-0.34; A8 1.25,-0.34; B5 1.75,-0.34; B6 0.75,-0.34; B7 -0.75,-0.34; B8 -1.75,-0.34 | smd 0.6 x 1: GND -3.225,-0.34; GND2 3.225,-0.34; VBUS1 -2.45,-0.34; VBUS2 2.45,-0.34 | smd 1 x 2.1: SHLD1 -4.32,-0.915; SHLD2 4.32,-0.915 | smd 1 x 2.1 bottom: SHLD3 -4.32,-0.915; SHLD4 4.32,-0.915 | smd 1 x 1.6: SHLD5 -4.32,-5.095; SHLD8 4.32,-5.095 | smd 1 x 1.6 bottom: SHLD6 -4.32,-5.095; SHLD7 4.32,-5.095 | hole 0.65: -2.89,-1.445; 2.89,-1.445
A0R-JMP = smd 1.5 x 1.3: 1 0,1.7; 2 0,0; 3 0,-1.7
INDUCTOR_4X4MM_NR401 = smd 1.2 x 3.7: P$1 -1.4,0; P$2 1.4,0
LED_0603 = smd 1 x 1.1: A -0.86,0; C 0.84,0
SOT23-3 = smd 0.8 x 0.9: 1 -0.95,-1; 2 0.95,-1; 3 0,1.1
SOT23-R = smd 0.635 x 1.016: 1 -0.95,-1; 2 0.95,-1; 3 0,1
R0603 = smd 1 x 1.1: 1 -0.85,0; 2 0.85,0
TACTILE_SWITCH_SMD_5.2MM = smd 1.524 x 0.762: 1 -2.794,1.905; 2 2.794,1.905; 3 -2.794,-1.905; 4 2.794,-1.905
SOT23 = smd 1.4 x 1: 1 -1.1,0.95; 2 -1.1,-0.95; 3 1.1,0
B1,27 = smd 1.27 x 1.27: TP 0,0
FH12-50S-0.5SH = smd 0.3 x 1.3: 1 -12.25,3.25; 2 -11.75,3.25; 3 -11.25,3.25; 4 -10.75,3.25; 5 -10.25,3.25; 6 -9.75,3.25; 7 -9.25,3.25; 8 -8.75,3.25; 9 -8.25,3.25; 10 -7.75,3.25; 11 -7.25,3.25; 12 -6.75,3.25; 13 -6.25,3.25; 14 -5.75,3.25; 15 -5.25,3.25; 16 -4.75,3.25; 17 -4.25,3.25; 18 -3.75,3.25; 19 -3.25,3.25; 20 -2.75,3.25; 21 -2.25,3.25; 22 -1.75,3.25; 23 -1.25,3.25; 24 -0.75,3.25; 25 -0.25,3.25; 26 0.25,3.25; 27 0.75,3.25; 28 1.25,3.25; 29 1.75,3.25; 30 2.25,3.25; 31 2.75,3.25; 32 3.25,3.25; 33 3.75,3.25; 34 4.25,3.25; 35 4.75,3.25; 36 5.25,3.25; 37 5.75,3.25; 38 6.25,3.25; 39 6.75,3.25; 40 7.25,3.25; 41 7.75,3.25; 42 8.25,3.25; 43 8.75,3.25; 44 9.25,3.25; 45 9.75,3.25; 46 10.25,3.25; 47 10.75,3.25; 48 11.25,3.25; 49 11.75,3.25; 50 12.25,3.25

### Placement (x,y rotation side)
C1  12.5,9 0 top
C2  83,16 180 top
C3  77,13 90 top
C4  17.5,4 90 top
C5  79.25,13 90 top
C6  78.25,9.75 90 top
C7  73.65,9.75 90 top
C8  21.5,15.5 0 top
C9  65,9 270 top
C10  21.5,8.5 180 top
C11  74.75,13 90 top
C12  80.5,9.75 90 top
C13  61.5,11 0 top
C14  61.5,8.5 0 top
C15  30.55,17.3 180 top
C16  34.05,17.3 0 top
C17  80.75,21.5 180 top
C18  84,21.5 180 top
C19  98,22 90 top
C20  82.75,9.75 90 top
C21  81.5,13 90 top
C22  83.75,13 90 top
C23  89.5,10 90 top
C24  85,9.75 90 top
C25  78,19 0 top
C26  83,18.5 0 top
C27  90.5,21.5 180 top
C28  94.5,28.25 180 top
C29  96.25,10 90 top
C30  94,10 90 top
C31  93,12.75 0 top
C32  98.5,10 90 top
C33  91.75,10 90 top
C34  67.5,9 270 top
C35  69,5.5 0 top
C36  94.5,23.75 180 top
C37  94.5,21.5 0 top
C38  94.5,26 0 top
C39  65.5,27.5 180 top
C40  26,15.5 180 top
C41  87.25,21.5 0 top
C42  73,27.5 180 top
D1  95,18.5 0 top
D2  88.5,18.5 0 top
D3  78,16 0 top
D4  67,17 180 top
D7  65.5,23 270 top
D8  61.5,26 270 top
D9  69.5,25.5 270 top
D10  15,12 0 top
FPC  84,27.5 180 top
IC1  12,5 90 top
IC2  26,18 180 top
IC3  50,14 180 top
IC4  21.5,12 270 top
IC5  32.28,21.3 180 top
J4  7.5,24.5 90 top
J5  22.5,2.5 0 top
J6  6.5,15 270 top
JMP1  85.5,3.5 90 bottom
L1  69,13 270 top
L2  73.5,23 0 top
L3  89,14 180 top
LED1  14.2,1.7 180 top
LED2  18.4,1.7 180 top
Q1  93,15.25 90 top
Q2  77.5,21.75 90 top
Q3  15,17 0 top
R1  97.25,12.75 0 top
R4  17.5,8 270 top
R5  10.8,1.6 180 top
R6  9.4,9 180 top
R7  68.5,2.5 90 top
R8  76,9.75 270 top
R9  36.5,8.5 180 top
R10  31,8.5 180 top
R11  26.25,8.5 180 top
R12  10.1,11.2 180 top
R13  97.25,15 0 top
R14  70,9 270 top
R15  25.8,21.3 270 top
R16  28.8,21.3 270 top
R17  38.8,21.3 90 top
R18  21.5,20.5 180 top
R19  21.5,18 0 top
R20  2.4,9 0 top
R21  6.1,9 180 top
R23  36.3,21.3 270 top
R24  74,19.5 180 top
R25  69.5,19.5 180 top
R36  10,14 180 top
R37  10,17 180 top
S1  63.5,3.5 180 top
S2  36.5,3.5 180 top
T1  26.25,12 90 top
T2  31,12 90 top
T3  72.5,16.5 180 top
TP2  31,15.25 90 top
X1  85,3 0 top

### Tracks (layer width: path | path; a pad name or v marks a point on that pad's centre or on a via)
3.3V  (via drill 0.35)
  Top 0.305: v91.7,4.2 91.7,4.3 | 91.7,4.3 91.25,4.75 X1.38 | X1.40 92.25,4.85 91.7,4.3 | 75.5,14.9 76,14.4 R8.1 75.4,10.6 75.1,10.3 75.1,8.1 74.25,7.25 X1.4 74.25,5.52 74.03,5.29 74.01,5.29 v73.7,4.98 | 75.5,14.9 75,14.9 74.7,15.2 74.7,16.5 74.9,16.7 74.9,17.45 T3.2 | 75.5,14.9 82.75,14.9 C2.1 85.6,16 L3.P$2 v88.8,14 | FPC.15 FPC.16 85.75,25.65 86.55,26.45 v86.6,26.4 | C42.1 74.9,26.45 74.9,26.2 | 74.9,26.2 L2.P$2 | C14.1 60.65,9.7 | 60.65,9.7 C13.1 | 64.9,9.85 C9.1 v66.3,9.85 C34.1 | 64.9,9.85 60.8,9.85 60.65,9.7 | 60.65,9.7 60.6,9.75 IC3.3 55.85,9.75 v55.8,9.8 | 74.9,26.2 v73.5,26.2 | v63.4,24.3 63.4,16 64.9,14.5 64.9,9.85 | T2.2 31.95,8.6 R10.1 | R10.1 v33.9,8.5 R9.2 | C10.1 22.44,8.59 IC4.5 | R10.1 31.85,7.75 31.1,7 22.5,7 22.35,7.15 C10.1 | C10.1 22.35,2.65 J5.1
  Bottom 0.305: JMP1.1 87.2,3.6 87.3,3.7 90.2,3.7 | v91.7,4.2 91.2,3.7 90.2,3.7 | 90.2,3.7 90.2,12.6 v88.8,14 88.8,24.8 87.2,26.4 v86.6,26.4 | v66.3,9.85 66.3,7.9 70.1,4.1 72.82,4.1 v73.7,4.98 | v73.5,26.2 65.3,26.2 v63.4,24.3 | v55.8,9.8 35.2,9.8 v33.9,8.5
BATTERY
  Top 0.305: R19.2 R18.1 22.35,21.15 25.9,24.7 49.3,24.7 50.85,23.15 IC3.22
BS0  (via drill 0.35)
  Top 0.305: X1.26 85.25,4.95 v85.2,4.9
  Bottom 0.305: JMP1.2 85.2,3.8 v85.2,4.9
CC3
  Top 0.305: R36.2 9.15,13.55 8.6,13 7.6,13 7.35,13.25 J6.B5
CC4
  Top 0.305: J6.A5 7.15,16.25 7.9,17 R37.2
D+  (via drill 0.35)
  Top 0.305: J6.A6 5.35,15.25 5.1,15 5.1,14.5 5.35,14.25 J6.B6 7.55,14.25 v8,13.8 | IC3.24 49.15,19.15 46.2,16.2 v46.2,14.1
  Bottom 0.305: v8,13.8 45.9,13.8 v46.2,14.1
D-  (via drill 0.35)
  Top 0.305: IC3.23 v50,17.5 | J6.B7 8.15,15.75 v8.2,15.8 8.2,15.2 7.75,14.75 J6.A7
  Bottom 0.305: v50,17.5 48.3,15.8 v8.2,15.8
EPD_BUSY  (via drill 0.35)
  Top 0.305: X1.29 86.75,7.65 v86.4,8 | FPC.9 82.25,25.05 81.4,25.9 81.4,26.8 81.8,27.2 v82.1,27.2 | IC3.9 63.25,14.85 v63.5,14.6
  Bottom 0.305: v82.1,27.2 82.27,27.2 82.88,26.58 82.88,11.52 v86.4,8 86.4,7.2 86,6.8 84.9,6.8 81.2,10.5 81.2,16.8 80.4,17.6 67.3,17.6 64.3,14.6 v63.5,14.6
EPD_CS  (via drill 0.35)
  Top 0.305: X1.31 87.75,8.75 v87.1,9.4 | v84,27.5 83.75,27.25 FPC.12 | IC3.12 v62.5,17.4 | v81.3,20.4 84.38,20.4 v84.4,20.38
  Bottom 0.305: v87.1,9.4 84.4,12.1 v84.4,20.38 84.4,25.2 84,25.6 v84,27.5 | v62.5,17.4 64.6,17.4 66.3,19.1 81.1,19.1 81.3,19.3 v81.3,20.4
EPD_DC  (via drill 0.35)
  Top 0.305: FPC.11 83.25,27.25 v83,27.5 | v87.2,4.9 87.25,4.95 X1.30 | IC3.11 61.45,16.55 v61.5,16.6
  Bottom 0.305: v83,27.5 83,27.4 83.5,26.9 83.5,12 87.2,8.3 87.2,6.3 | 87.2,6.3 v87.2,4.9 | v61.5,16.6 61.5,14.4 62.2,13.7 64.6,13.7 67.7,16.8 79.74,16.8 80.4,16.14 80.4,10.1 84.2,6.3 87.2,6.3
EPD_DIN  (via drill 0.35)
  Top 0.305: X1.33 88.75,7.15 v89.2,7.6 | FPC.14 84.75,25.45 85.6,26.3 v85.6,27.4 85.6,27.7 85.1,28.2 80.7,28.2 v80.2,27.7 | v45.6,19.8 45.45,19.95 IC3.31
  Bottom 0.305: v89.2,7.6 89.2,10.3 85.9,13.6 85.9,27.4 v85.6,27.4 | v80.2,27.7 80.2,22 79,20.8 65.3,20.8 64.3,19.8 v45.6,19.8
EPD_RST  (via drill 0.35)
  Top 0.305: X1.28 86.25,7.15 85.8,7.6 v85.3,7.6 | v82.1,26.2 82.1,26 82.75,25.35 FPC.10 | v62.6,15.7 IC3.10
  Bottom 0.305: v85.3,7.6 85.3,7.7 82.1,10.9 82.1,18.3 | v82.1,26.2 82.1,18.3 | 82.1,18.3 66.9,18.3 64.3,15.7 v62.6,15.7
EPD_SCK  (via drill 0.35)
  Top 0.305: X1.32 88.25,5.05 v88.4,4.9 | v84.8,26.6 84.25,26.05 FPC.13 | IC3.32 44.3,19.1 v44.5,18.9
  Bottom 0.305: v88.4,4.9 88.4,9.4 85.3,12.5 85.3,25 84.8,25.5 v84.8,26.6 84.8,27.8 84.4,28.2 81.8,28.2 81.1,27.5 81.1,21.8 79.3,20 65.8,20 64.7,18.9 v44.5,18.9
GDR  (via drill 0.35)
  Top 0.305: v78.7,21.7 78.5,21.5 Q2.1 77.64,19.94 76.61,19.94 76.1,19.43 76.1,19 75.6,18.5 71.35,18.5 R25.1 | v78.8,25.5 78.75,25.45 FPC.2
  Bottom 0.305: v78.8,25.5 78.7,25.4 v78.7,21.7
GDRC  (via drill 0.35)
  Top 0.305: X1.9 76.75,7 77.45,7.7 v77.45,7.8 77.4,7.8 76.3,8.9 R8.2 | T3.1 73,14.95 v73,14.2
  Bottom 0.305: v73,14.2 73.5,13.7 73.5,11.75 v77.45,7.8
GDRH  (via drill 0.35)
  Top 0.305: Q1.1 94.8,14.3 96.35,12.75 | 96.35,12.75 R1.1 | X1.5 74.75,5.15 v74.9,5 | v73.9,2.8 74.4,2.3 76.8,2.3 77.2,2.7 94.6,2.7 v95,3.1 | v96.9,13.9 96.35,13.35 96.35,12.75
  Bottom 0.305: v74.9,5 73.9,4 v73.9,2.8 | v95,3.1 96.9,5 v96.9,13.9
GND  (via drill 0.35)
  Top 0.305: FPC.8 81.75,21.65 C17.1 81.18,21.08 81.02,21.08 80.23,20.3 80.2,20.3 80.1,20.2 80.1,19 C25.2 | X1.39 91.75,7.45 v91.7,7.5 91.25,7.5 90.49,8.27 90.49,10.9 89.55,10.9 | C30.2 94.9,11.75 v94.9,11.8 97.3,11.8 98.25,10.85 C32.2 98.1,11.25 R1.2 | C23.2 89.55,10.9 | v82.4,4.8 82.75,5.15 X1.21 82.75,4.85 | C20.2 82.6,10.75 82.6,13.8 82.65,13.85 C22.2 | C2.2 83.25,17.1 86.7,17.1 v87.1,16.7 87.64,16.16 88.33,16.16 89.48,15 89.48,13.62 89.4,13.53 89.4,11.05 89.55,10.9 | C11.2 74.65,13.75 73.75,13.75 72.5,12.5 v72.3,12.5 | J6.GND2 6.83,11.78 8.4,10.2 | IC1.1 14.4,3.1 v13,4.5 | 13.15,9 C1.2 | J6.GND 6.72,18.23 7.6,19.1 v7.6,19.7 | X1.12 78.25,4.55 v78,4.3 | X1.8 76.25,7.54 v76.41,7.7 | X1.27 85.79,6.21 85.79,5.48 86.2,5.07 v86.2,4.9 | C6.2 78.1,10.75 v78.1,13.1 | C12.2 80.4,10.7 80.4,13.8 80.3,13.9 81.45,13.9 C21.2 | FPC.17 86.25,25.15 86.57,25.47 | 86.57,25.47 86.6,25.5 | 86.57,25.47 v87.17,25.47 | IC5.7 32.62,20.97 31.97,20.32 IC5.1 | IC2.6 25.75,18.25 25.9,18.1 | 25.9,18.1 IC2.9 | 25.9,18.1 26.32,18.52 26.32,18.53 26.54,18.75 IC2.4 | IC2.1 26.45,17.25 25.9,17.8 25.9,18.1 | R21.1 6.8,8.85 6.8,7
  Bottom 0.305: v76.41,7.7 75.6,8.51 75.6,8.6 75.3,8.9 74.3,8.9 | v86.2,4.9 85.36,5.74 83.34,5.74 v82.4,4.8
  other vias: 70.9,27.5 69.5,6.9 72.1,10.8 66.2,12.1 78.6,15.9 28.6,16.6 28.7,14.9 28,12.2 23.5,12.1 13.3,7.7 15,14.8 14.7,12.8 11.9,14.9 12.4,17 63.6,8.4 63.7,11.5 70.5,21.7 54.5,8.5 52.5,8.5 50.5,8.5 48.5,8.5 46.5,8.5 44.5,8.5 44.5,11.5 55.5,11.5 53,13 53,11 51,11 49,11 47,11 48.25,14 50,14 50,15.75 51.75,15.75 63.45,3.47 26,16.8
  pour Bottom (isolate 0.254): 8,0 8,6.5 arc90 6.5,8 0,8 0,28 arc-90 2,30 98,30 arc-90 100,28 100,2 arc-90 98,0
  pour Top (isolate 0.254): 8,0 8,6.5 arc90 6.5,8 0,8 0,28 arc-90 2,30 98,30 arc-90 100,28 100,2 arc-90 98,0
  pour Top: 7.1,4.9 arc-90 6.1,3.9 arc-90 5.1,4.9 5.1,6.4 arc-90 6.1,7.4 arc-90 7.1,6.4
IO0  (via drill 0.35)
  Top 0.305: IC3.4 v59.1,10.6 | v59.4,7 65.2,7 66.29,5.91 S1.3
  Bottom 0.305: v59.1,10.6 59.4,10.3 v59.4,7
N$1
  Top 0.305: 8.92,5.63 IC1.6 8.46,5.63 7.7,6.4 7.7,8.15 R6.2
N$2
  Top 0.305: R5.1 13.26,1.6 LED1.C
N$3  (via drill 0.35)
  Top 0.305: LED2.C 17.46,1.6 v16.5,1.6 | v9,7.7 10.25,8.95 R6.1
  Bottom 0.305: v16.5,1.6 14.3,1.6 9,6.9 v9,7.7
N$4
  Top 0.305: R4.2 14.71,4.37 IC1.2
N$5
  Top 0.305: C7.1 73.65,8.05 73.25,7.65 X1.2
N$6
  Top 0.305: IC1.7 8.82,4.37 8.3,3.85 8.3,2.3 9.1,1.5 9.85,1.5 R5.2
N$7  (via drill 0.35)
  Top 0.305: C3.1 77.2,11.95 v77.2,10.9 | v81.3,4.4 80.7,4.4 79.75,5.35 X1.15
  Bottom 0.305: v77.2,10.9 81.3,6.8 v81.3,4.4
N$8
  Top 0.305: X1.17 80.75,7.35 80.2,7.9 79.9,7.9 79.4,8.4 79.4,12 C5.1
N$9
  Top 0.305: T1.3 28.3,13.1 30.05,11.35 T2.1 30.05,8.6 R10.2
N$10
  Top 0.305: R17.2 38.8,22.8 37.8,23.8 34.1,23.8 33.08,22.78 IC5.5
N$12
  Top 0.305: FPC.5 80.25,23.15 79.9,22.8 C17.2
N$13  (via drill 0.35)
  Top 0.305: v30.2,19.4 30.2,20.5 30.68,20.98 30.68,20.97 IC5.2 | v36.3,19.3 R23.2
  Bottom 0.305: v30.2,19.4 36.2,19.4 v36.3,19.3
N$14
  Top 0.305: C18.2 83.15,22.35 83.8,23 86.5,23 86.75,23.25 FPC.18
N$15
  Top 0.305: C27.2 89.65,22.05 88.9,22.8 88.3,22.8 87.75,23.35 FPC.20
N$16
  Top 0.305: D2.A 85.85,19 84,19 | 84,19 C26.2 | D3.C 81.75,17.6 83.2,17.6 84,18.4 84,19
N$17
  Top 0.305: D1.A 92.85,16.2 Q1.3 91.65,15.25 L3.P$1 90.4,15.2 88.5,17.1 88.5,19.6 88.4,19.7 82.6,19.7 82.15,19.25 C26.1
N$18
  Top 0.305: T1.1 25.4,10.8 R11.2
N$31
  Top 0.305: FPC.22 88.75,28.28 89.3,28.83 93.07,28.83 C28.2
N$32
  Top 0.305: FPC.24 92.45,24.25 92.95,23.75 C36.2
N$35
  Top 0.305: C6.1 78.25,8.85 79.7,7.4 79.9,7.4 80.25,7.05 X1.16
N$47
  Top 0.305: C11.1 74.55,11.95 74.55,8.22 73.75,7.42 X1.3
N$49
  Top 0.305: X1.18 81.25,7.95 80.5,8.7 C12.1
N$50
  Top 0.305: C20.1 82.75,7.95 82.25,7.45 X1.20
N$51
  Top 0.305: X1.19 81.75,11.9 C21.1
N$52
  Top 0.305: C22.1 83.75,8.05 83.25,7.55 X1.22
N$53
  Top 0.305: C23.1 89.5,8.5 90.75,7.25 X1.37
N$54
  Top 0.305: X1.23 83.75,7.15 85,8.4 C24.1
N$55
  Top 0.305: C29.1 96.25,8.45 95.25,7.45 X1.46
N$56
  Top 0.305: X1.45 94.75,7.85 95.2,8.3 95.2,10.3 95.75,10.85 C29.2
N$57
  Top 0.305: C30.1 94.25,8.9 X1.44
N$58  (via drill 0.35)
  Top 0.305: X1.41 92.75,4.75 93.2,4.3 v93.2,4.2 | v92.8,11.7 92.15,12.35 C31.1
  Bottom 0.305: v93.2,4.2 93.2,11.3 v92.8,11.7
N$59
  Top 0.305: X1.50 97.25,6.85 98.5,8.1 C32.1
N$61
  Top 0.305: X1.43 93.75,7.55 92.15,9.15 C33.1
N$62
  Top 0.305: X1.42 93.25,7.35 92.4,8.2 91.2,8.2 90.94,8.46 90.94,10.24 91.55,10.85 C33.2
N$63
  Top 0.305: C39.2 64.65,26 D7.A 62.8,25.15 D8.C
N$64
  Top 0.305: T3.3 71.4,15.5 70.3,14.4 69.7,14.4 L1.P$1 66.3,14.4 64.85,15.85 D4.C
N$65  (via drill 0.35)
  Top 0.305: Q2.3 v76.4,23.2 | v73.4,24.5 72.1,23.2 L2.P$1 72.1,24.1 69.5,26.7 69.5,27.5 C39.1 69.35,27.5 D9.A
  Bottom 0.305: v76.4,23.2 75.1,24.5 v73.4,24.5
N$67
  Top 0.305: C41.2 88.1,22 87.25,22.85 FPC.19
PREVGH  (via drill 0.35)
  Top 0.305: C37.1 91.85,23.3 88.52,23.3 88.25,23.57 FPC.21 88.25,25.95 v86.8,27.4 | v69.5,24.9 D9.C
  Bottom 0.305: v86.8,27.4 85.4,28.8 77.77,28.8 74.38,25.42 70.02,25.42 v69.5,24.9
PREVGL  (via drill 0.35)
  Top 0.305: C38.1 v89.9,26 89.25,25.35 FPC.23 | D8.A 62.18,28.83 86.6,28.83 86.9,28.53 v86.9,28.5
  Bottom 0.305: v86.9,28.5 89.4,26 v89.9,26
RESE
  Top 0.305: FPC.3 79.25,23.15 78.8,22.7 Q2.2 78.3,22.7 77.7,22.1 77.7,21.4 77.1,20.8 76.15,20.8 R24.1
RESEC
  Top 0.305: L1.P$2 69,10.85 R14.1 70.75,9.85 71.8,8.8 71.8,5.4 72.9,4.3 76.05,4.3 77.28,5.52 77.28,6.22 X1.10
RESEH  (via drill 0.35)
  Top 0.305: R13.1 96.4,15.4 v95.65,16.15 95.35,16.15 95.3,16.2 Q1.2 | v94.1,3.6 93.9,3.4 76.9,3.4 76.6,3.1 v75.3,3.1 | v75.5,7.5 75.25,7.25 X1.6
  Bottom 0.305: v95.65,16.15 95.65,5.15 v94.1,3.6 | v75.5,7.5 75.6,7.4 75.6,3.4 v75.3,3.1
RST
  Top 0.305: R9.1 37.62,8.22 37.8,8.05 | 37.8,8.05 39.29,6.56 S2.3 | IC3.45 37.8,8.05
RX  (via drill 0.35)
  Top 0.305: v35.5,11.8 36,12.3 IC3.40
  Bottom 0.305: J5.4 30.12,6.42 v35.5,11.8
SCL  (via drill 0.35)
  Top 0.305: v44.3,22.4 44.9,21.8 IC3.29 | v28.35,18.95 26.85,20.45 R15.2 24.75,20.45 23.9,19.6 23.9,18 24.15,17.75 IC2.7 | IC5.4 31.23,22.52 v31.23,23.3
  Bottom 0.305: v28.35,18.95 31.23,21.83 v31.23,23.3 43.4,23.3 v44.3,22.4
SDA  (via drill 0.35)
  Top 0.305: IC3.28 45.75,22.15 v44.4,23.5 | v24,16.8 24.45,17.25 IC2.8 | 30.02,21.68 30.16,21.81 v30.16,22.54 | 30.02,21.68 30.08,21.62 IC5.3 | R16.2 30.02,21.68
  Bottom 0.305: v44.4,23.5 43.66,24.24 30.61,24.24 29.46,23.09 | 29.46,23.09 24,17.63 v24,16.8 | 30.04,22.54 v30.16,22.54 29.61,23.09 29.46,23.09
SENS  (via drill 0.35)
  Top 0.305: R11.1 28.7,10.1 v28.7,11.2 | IC3.17 v55.1,16.6
  Bottom 0.305: v28.7,11.2 30.4,12.9 51.4,12.9 v55.1,16.6
TX  (via drill 0.35)
  Top 0.305: IC3.39 35.15,13.15 v33.9,11.9
  Bottom 0.305: v33.9,11.9 27.58,5.58 J5.3
VBAT  (via drill 0.35)
  Top 0.305: R19.1 20.65,17.9 | 20.65,17.9 C8.1 20.65,14.3 | 20.65,14.3 20.65,13.34 IC4.3 20.56,12.86 v19.3,11.6 | 20.65,14.3 20.85,14.5 22.7,14.5 | 26.9,15.45 26.9,14.9 26.5,14.5 22.7,14.5 | 26.9,15.45 C40.1 | IC4.1 22.7,13.51 22.7,14.5 | IC1.5 v10.15,7.63 11.04,7.63 11.65,8.25 C1.1 | J4.1 11.7,25.5 19.3,17.9 20.65,17.9 | IC2.2 27,18 | 27,18 IC2.3 | 27,18 27.7,18 27.8,17.9 27.8,16.35 26.9,15.45
  Bottom 0.305: v19.3,11.6 14.12,11.6 v10.15,7.63
VBUS
  Top 0.305: J6.VBUS1 7.15,17.45 8.2,18.5 12.4,18.5 14.05,16.85 Q3.1 12.85,14.8 D10.A 12.55,12.3 10,12.3 9.25,11.55 R12.2 8.35,11.2 7,12.55 J6.VBUS2
VGH
  Top 0.305: X1.49 96.75,2.35 95.6,1.2 69.6,1.2 69.4,1.4 68.75,1.4 R7.1
VGL  (via drill 0.35)
  Top 0.305: C25.1 77.15,15.7 v77.12,15.68 76.8,16 D3.A | v78.4,7.7 78.75,7.35 X1.13
  Bottom 0.305: v77.12,15.68 76.1,14.65 76.1,10.6 78.4,8.3 v78.4,7.7
VIN  (via drill 0.35)
  Top 0.305: LED2.A 19.26,2.39 18.5,3.15 C4.1 16.25,3.15 v16.2,3.2 16.2,2.84 LED1.A 14.91,1.7 | IC1.8 9.99,3.1 13.8,6.91 IC1.4 v14.58,8.6 14.58,10.28 16.3,12 D10.C 17.15,14.8 Q3.2
  Bottom 0.305: v16.2,3.2 14.58,4.82 v14.58,8.6
VPC  (via drill 0.35)
  Top 0.305: X1.11 77.75,5.15 76.4,3.8 72.48,3.8 71.78,4.5 71.1,4.5 | 71.1,4.5 69.3,4.5 68.3,5.5 C35.1 | D4.A 69.15,16.95 69.3,16.8 v69.3,15.7 | v71,5.2 71.1,5.1 71.1,4.5
  Bottom 0.305: v69.3,15.7 71,14 v71,5.2
VPH  (via drill 0.35)
  Top 0.305: v79.2,4.3 79.25,4.35 X1.14 | D1.C 97.15,18.9 v98,19.75 C19.1 | R7.2 67.45,3.35 v66.9,3.9 | v78.3,1.9 v95.1,1.9
  Bottom 0.305: v98,19.75 98,4.7 95.2,1.9 v95.1,1.9 | v66.9,3.9 68.9,1.9 v78.3,1.9 79.3,2.9 79.3,4.2 v79.2,4.3
VSENS
  Top 0.305: R17.1 37.1,22.15 R23.1 35.77,21.62 34.7,21.62 | 34.7,21.62 34.7,20.6 34.4,20.3 34.38,20.32 33.33,20.32 | R16.1 28.88,22.23 | 28.88,22.23 30.65,24 31.7,24 32.38,23.32 32.38,22.04 32.8,21.62 IC5.6 34.7,21.62 | R15.1 25.88,22.23 28.88,22.23 | T2.3 TP2.TP 31.4,15.65 C15.1 C16.1 33.2,20.19 33.33,20.32 | IC5.8 33.33,20.32
VSOL  (via drill 0.35)
  Top 0.305: v15.1,19.3 15.1,18.1 Q3.3 | v2.3,12.6 2.8,12.1 2.8,10.2 1.6,9 R20.1 1.8,8.75 1.8,6.7
  Bottom 0.305: v15.1,19.3 9,19.3 v2.3,12.6
  pour Top: 3.6,4.8 arc-90 2.6,3.8 arc-90 1.6,4.8 1.6,6.3 arc-90 2.6,7.3 arc-90 3.6,6.3
VSOLAR  (via drill 0.35)
  Top 0.305: IC3.21 51.7,23.7 49.2,26.2 18.8,26.2 v16.6,24 | R21.2 3.9,9 | 3.9,9 R20.2 | 3.9,9 3.9,11.15 3.56,11.49 3.56,19.76 v7.6,23.8
  Bottom 0.305: v7.6,23.8 16.4,23.8 v16.6,24

### Text on the board
tNames: Vsens | JLCJLCJLCJLC | CHRG | STDBY
bNames: 4-line SPI | 3-line SPI
tValues: 7.5" | 7.3"